# Altium schematic sheet MAGIsDebugger-STLink.SchDoc
size A4
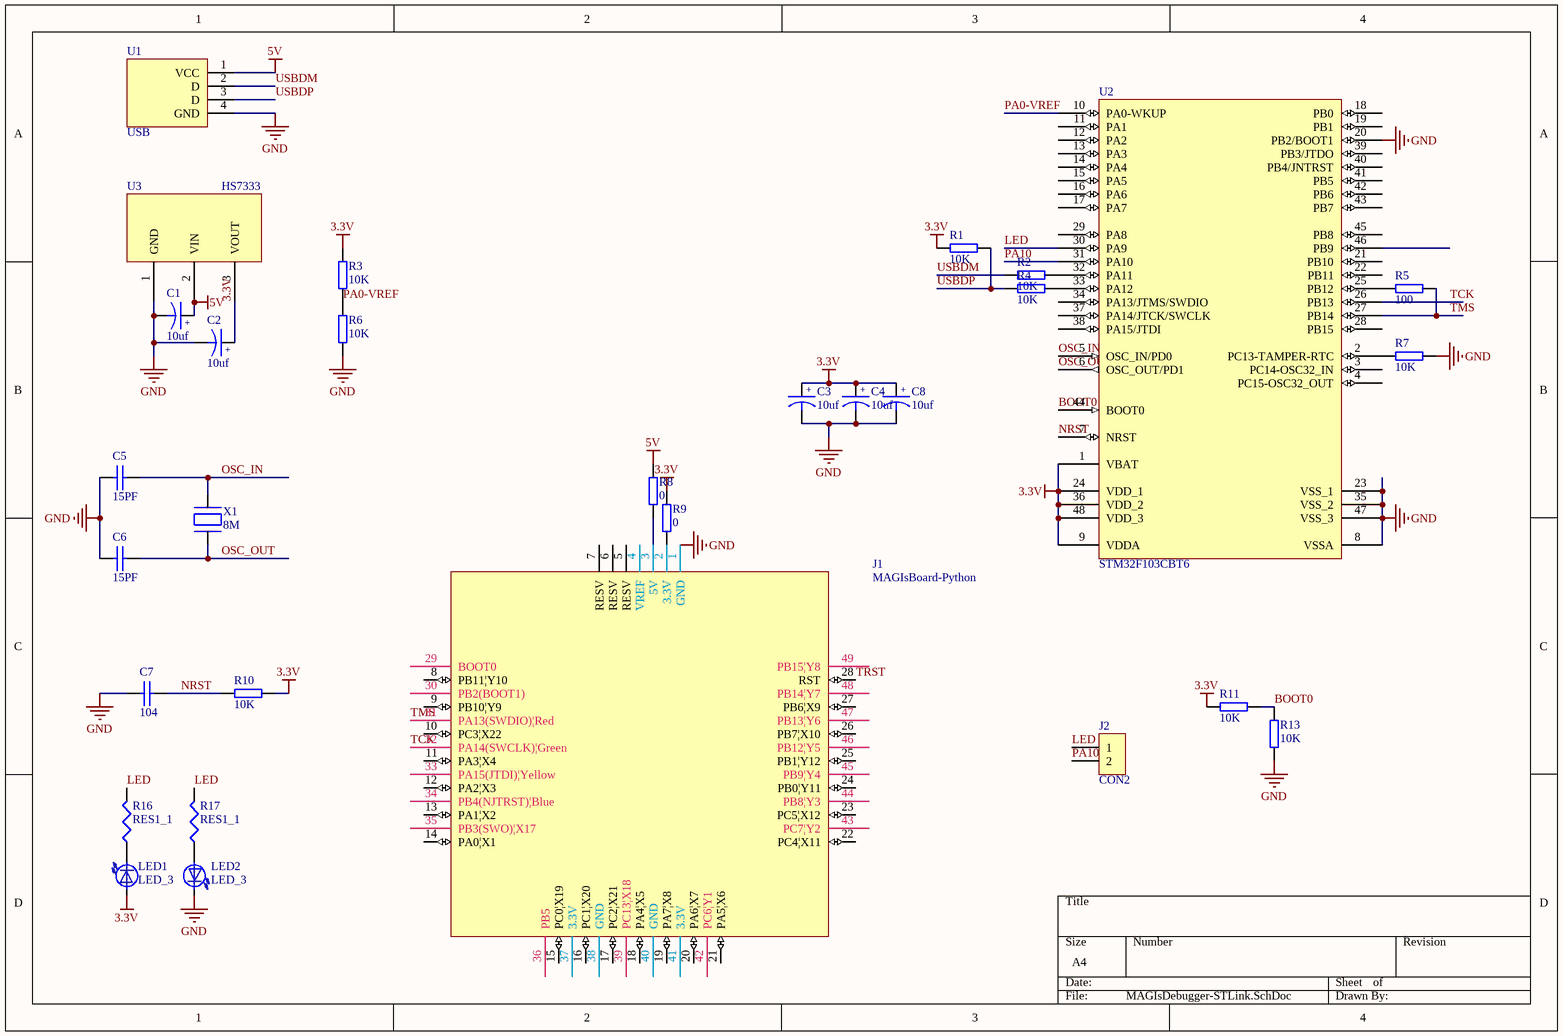
[diagram p0: MAGIsDebugger-STLink.SchDoc]

## Parts
C1  10uf  [6-0805_n]
C2  10uf  [6-0805_n]
C3  10uf  [6-0805_n]
C4  10uf  [6-0805_N]
C5  15PF  [6-0805_n]
C6  15PF  [6-0805_n]
C7  104  [6-0805_n]
C8  10uf  [6-0805_N]
J1  MAGIsBoard-Python  [MAGIsBoard-Python]
J2  CON2  [SIP2]
LED1  LED_3  [6-0805_n]
LED2  LED_3  [6-0805_n]
R1  10K  [6-0805_n]
R2  10K  [6-0805_n]
R3  10K  [6-0805_n]
R4  10K  [6-0805_n]
R5  100  [6-0805_n]
R6  10K  [6-0805_n]
R7  10K  [6-0805_n]
R8  0  [6-0805_n]
R9  0  [6-0805_n]
R10  10K  [6-0805_n]
R11  10K  [6-0805_n]
R13  10K  [6-0805_n]
R16  RES1_1  [6-0805_n]
R17  RES1_1  [6-0805_n]
U1  USB  [microUSB]
U2  STM32F103CBT6  [LQFP48_N]
U3  HS7333  [HS7333]
X1  8M  [5032]

## Nets
3.3V: C2.1 C3.1 C4.1 C8.1 LED1.1(A) R1.1 R3.2 R9.1 R10.2 R11.2 U2.1(VBAT) U2.9(VDDA) U2.24(VDD_1) U2.36(VDD_2) U2.48(VDD_3) U3.3(VOUT)
5V: C1.1 R8.1 U1.1(VCC) U3.2(VIN)
GND: C1.2 C2.2 C3.2 C4.2 C5.1 C6.1 C7.1 C8.2 J1.1(GND) LED2.2(K) R6.1 R7.1 R13.1 U1.4(GND) U2.8(VSSA) U2.20(PB2/BOOT1) U2.23(VSS_1) U2.35(VSS_2) U2.47(VSS_3) U3.1(GND)
BOOT0: R11.1 R13.2 U2.44(BOOT0)
LED: J2.1 R16.2 R17.2 U2.30(PA9)
NRST: C7.2 R10.1 U2.7(NRST)
OSC_IN: C5.2 U2.5(OSC_IN/PD0) X1.1
OSC_OUT: C6.2 U2.6(OSC_OUT/PD1) X1.2
PA0-VREF: R3.1 R6.2 U2.10(PA0-WKUP)
PA10: J2.2 U2.31(PA10)
TCK: J1.32(PA14(SWCLK)|Green) U2.26(PB13)
TMS: J1.31(PA13(SWDIO)|Red) R5.1 U2.27(PB14)
TRST: J1.28(RST)
USBDM: R2.1 U1.2(D)
USBDP: R1.2 R4.1 U1.3(D)
NetJ1_2: J1.2(3.3V) R9.2
NetJ1_3: J1.3(5V) R8.2
NetLED1_2: LED1.2(K) R16.1
NetLED2_1: LED2.1(A) R17.1
NetR2_2: R2.2 U2.32(PA11)
NetR4_2: R4.2 U2.33(PA12)
NetR5_2: R5.2 U2.25(PB12)
NetR7_2: R7.2 U2.2(PC13-TAMPER-RTC)

Not connected (* = marked no-connect by the designer): J1 4(VREF) 5(RESV) 6(RESV) 7(RESV) 8(PB11|Y10) 9(PB10|Y9) 10(PC3|X22) 11(PA3|X4) 12(PA2|X3) 13(PA1|X2) 14(PA0|X1) 15(PC0|X19) 16(PC1|X20) 17(PC2|X21) 18(PA4|X5) 19(PA7|X8) 20(PA6|X7) 21(PA5|X6) 22(PC4|X11) 23(PC5|X12) 24(PB0|Y11) 25(PB1|Y12) 26(PB7|X10) 27(PB6|X9) 29(BOOT0) 30(PB2(BOOT1)) 33(PA15(JTDI)|Yellow) 34(PB4(NJTRST)|Blue) 35(PB3(SWO)|X17) 36(PB5) 37(3.3V) 38(GND) 39(PC13|X18) 40(GND) 41(3.3V) 42(PC6|Y1) 43(PC7|Y2) 44(PB8|Y3) 45(PB9|Y4) 46(PB12|Y5) 47(PB13|Y6) 48(PB14|Y7) 49(PB15|Y8); U2 3(PC14-OSC32_IN) 4(PC15-OSC32_OUT) 11(PA1) 12(PA2) 13(PA3) 14(PA4) 15(PA5) 16(PA6) 17(PA7) 18(PB0) 19(PB1) 21(PB10) 22(PB11) 28(PB15) 29(PA8) 34(PA13/JTMS/SWDIO) 37(PA14/JTCK/SWCLK) 38(PA15/JTDI) 39(PB3/JTDO) 40(PB4/JNTRST) 41(PB5) 42(PB6) 43(PB7) 45(PB8) 46(PB9)

## Notes on the sheet
- (in symbol CAPACITOR POL) +

## Library data of the parts
C1-C4 C8 = CAPACITOR POL: Capacitor
C5-C7 = CAP
J2 = CON2: Connector
R1-R11 R13 = RES
U2 = STM32F103CBT6: STM32 ARM-based 32-bit MCU with 128 Kbytes Flash, 48-pin LQFP, Industrial Temperature; Published: 30-May-2008; DatasheetVersion: rev6, Mar-2008; PackageVersion: Mar-2008; PackageReference: LQFP48; Publisher: Altium Limited; PackageDescription: 48-Pin Low-Profile Quad Flat Pack, 7 x 7 mm Body, 0.5 mm Pitch (LQFP48); ComponentLink1Description: Manufacturer Link; ComponentLink1URL: www.st.com/stm32; ComponentLink2Description: Datasheet; ComponentLink2URL: http://www.st.com/stonline/products/literature/ds/13587.pdf
X1 = CRYSTAL